# EAGLE design PCBLAGO (EAGLE 9.5.1)
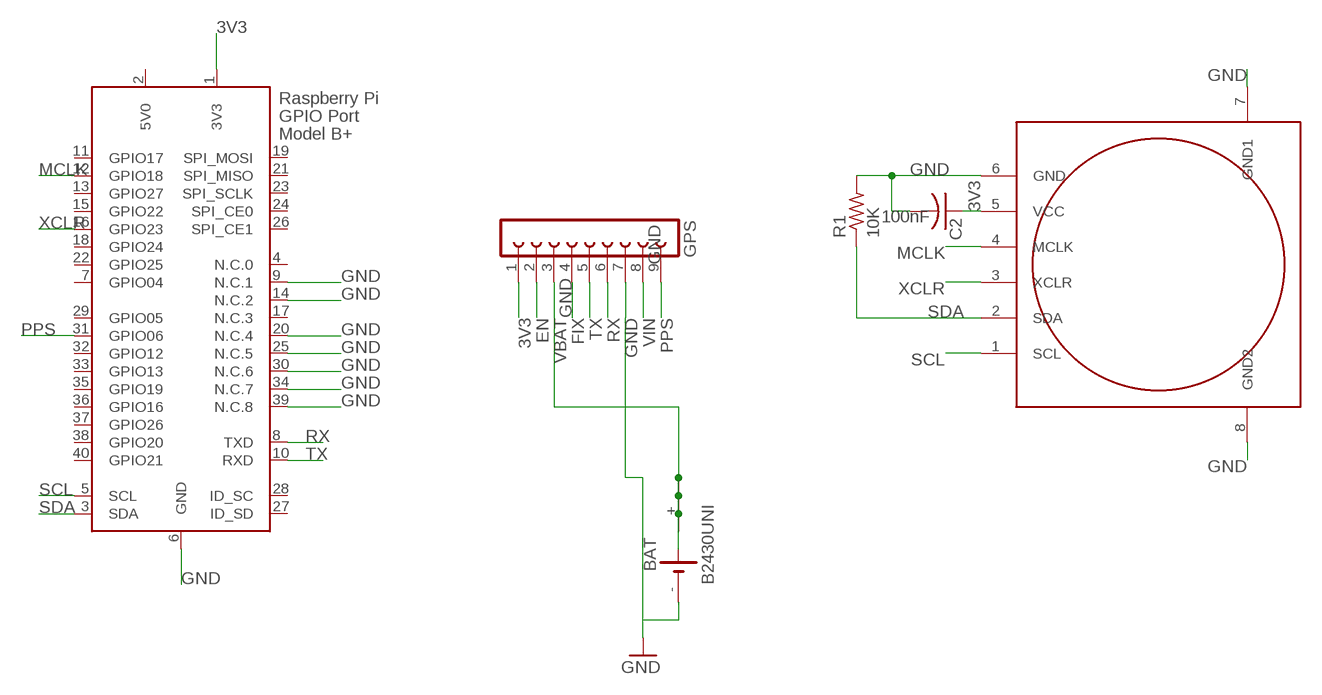
[diagram p0: schematic, sheet 1]

## Parts
BAT  B2430UNI  [B2430UNI]
C2  100nF  C-USC0805K  [C0805K]
GPS  FE09-1  [FE09]
R1  10K  R-US_M0805  [M0805]
U$1  HP03S  [HP03S]
X1  RASPI_BOARD_B+_F  [RASPI_BOARD_B+_FULL]

## Nets
3V3 [New Class]: C2.1 GPS.1 U$1.5(VCC) X1.1(3V3)
EN: GPS.2
FIX: GPS.4
GND: BAT.- C2.2 GPS.7 R1.2 U$1.6(GND) U$1.7(GND1) U$1.8(GND2) X1.6(GND) X1.9(N.C.1) X1.14(N.C.2) X1.20(N.C.4) X1.25(N.C.5) X1.30(N.C.6) X1.34(N.C.7) X1.39(N.C.8)
MCLK: U$1.4(MCLK) X1.12(GPIO18)
PPS: GPS.9 X1.31(GPIO06)
RX: GPS.6 X1.8(TXD)
SCL: U$1.1(SCL) X1.5(SCL)
SDA: R1.1 U$1.2(SDA) X1.3(SDA)
TX: GPS.5 X1.10(RXD)
VBAT: BAT.+ BAT.+@1(+) BAT.+@2(+) BAT.+@3(+) BAT.+@4(+) GPS.3
VIN: GPS.8
XCLR: U$1.3(XCLR) X1.16(GPIO23)
Unconnected: BAT.-@1(-) X1.4(N.C.0) X1.7(GPIO04) X1.11(GPIO17) X1.13(GPIO27) X1.15(GPIO22) X1.17(N.C.3) X1.18(GPIO24) X1.19(SPI_MOSI) X1.21(SPI_MISO) X1.22(GPIO25) X1.23(SPI_SCLK) X1.24(SPI_CE0) X1.26(SPI_CE1) X1.27(ID_SD) X1.28(ID_SC) X1.29(GPIO05) X1.32(GPIO12) X1.33(GPIO13) X1.35(GPIO19) X1.36(GPIO16) X1.37(GPIO26) X1.38(GPIO20) X1.40(GPIO21)

## Power pins joined to a net without a drawn wire
5V0: X1.2(5V0)

## Library data of the parts
BAT = battery:B2430UNI: LI BATTERY
C2 = rcl:C-US: CAPACITOR, American symbol
GPS = con-lsta:FE09-1: FEMALE HEADER; OC_FARNELL: unknown; OC_NEWARK: unknown
R1 = rcl:R-US_: RESISTOR, American symbol
U$1 = LAGO:HP03S
X1 = raspberrypi_bastelstube_v13:RASPI_BOARD_B+: Raspberry Pi GPIO connector with markings for the outer dimensions of the Raspberry Pi board model B+ with different sets of drill holes or mounting pads

## Board
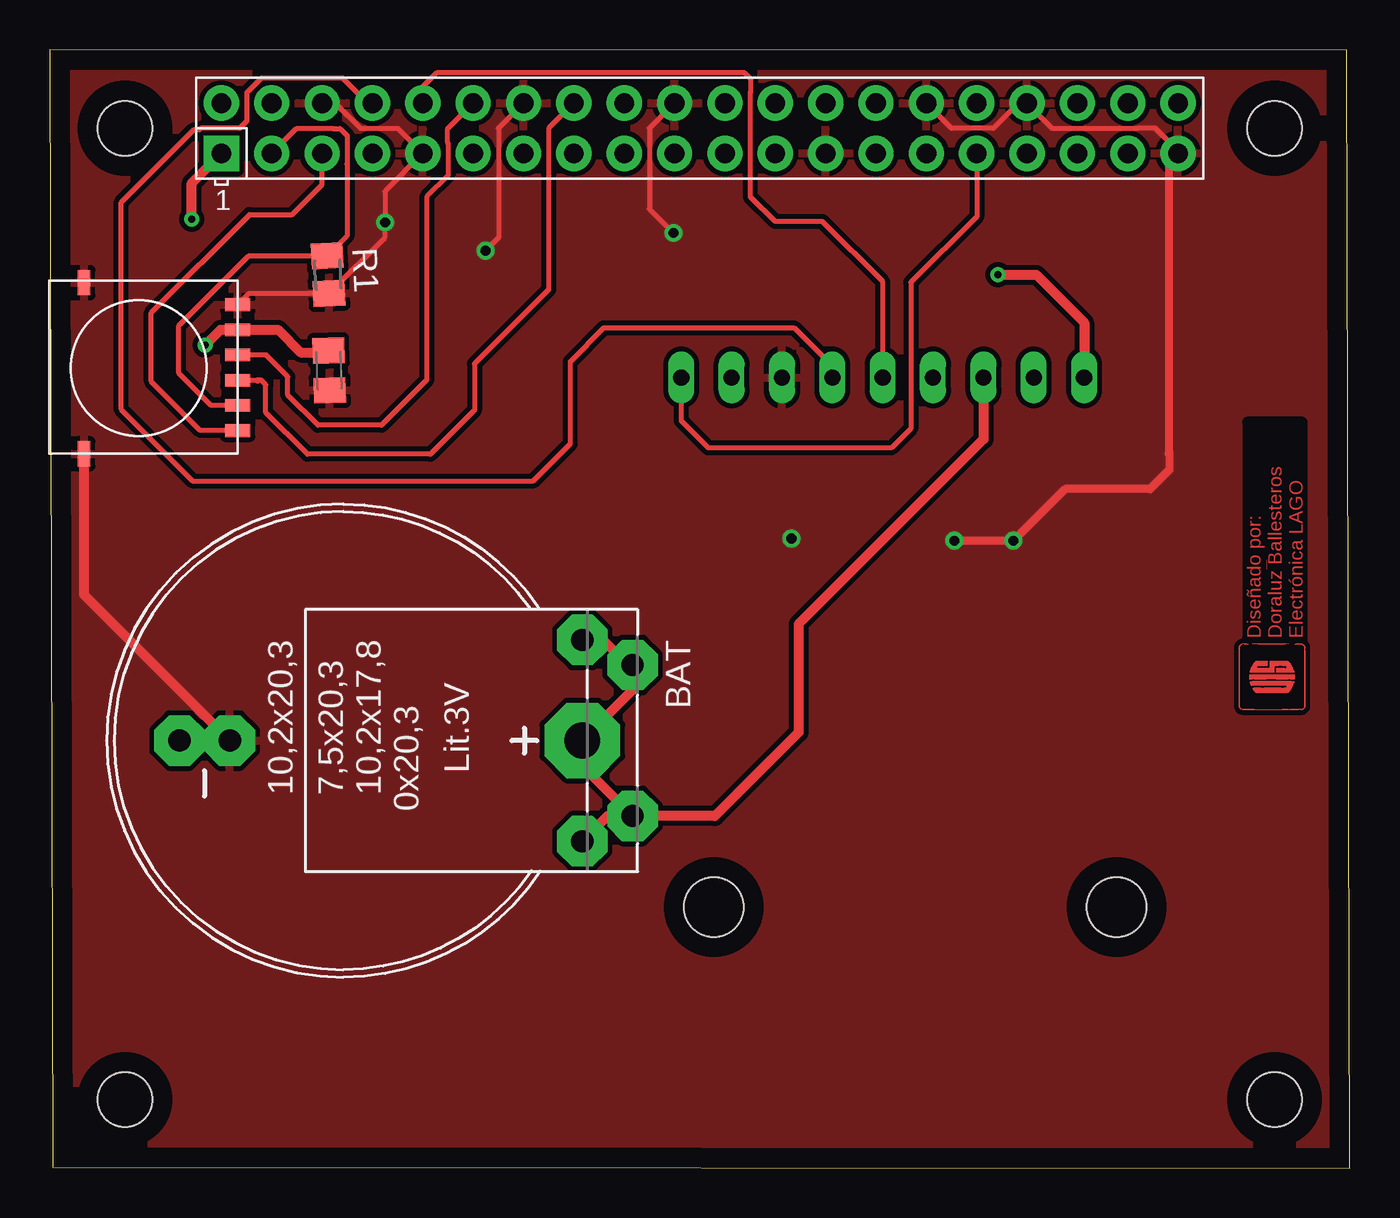
[diagram p1: board, top side]
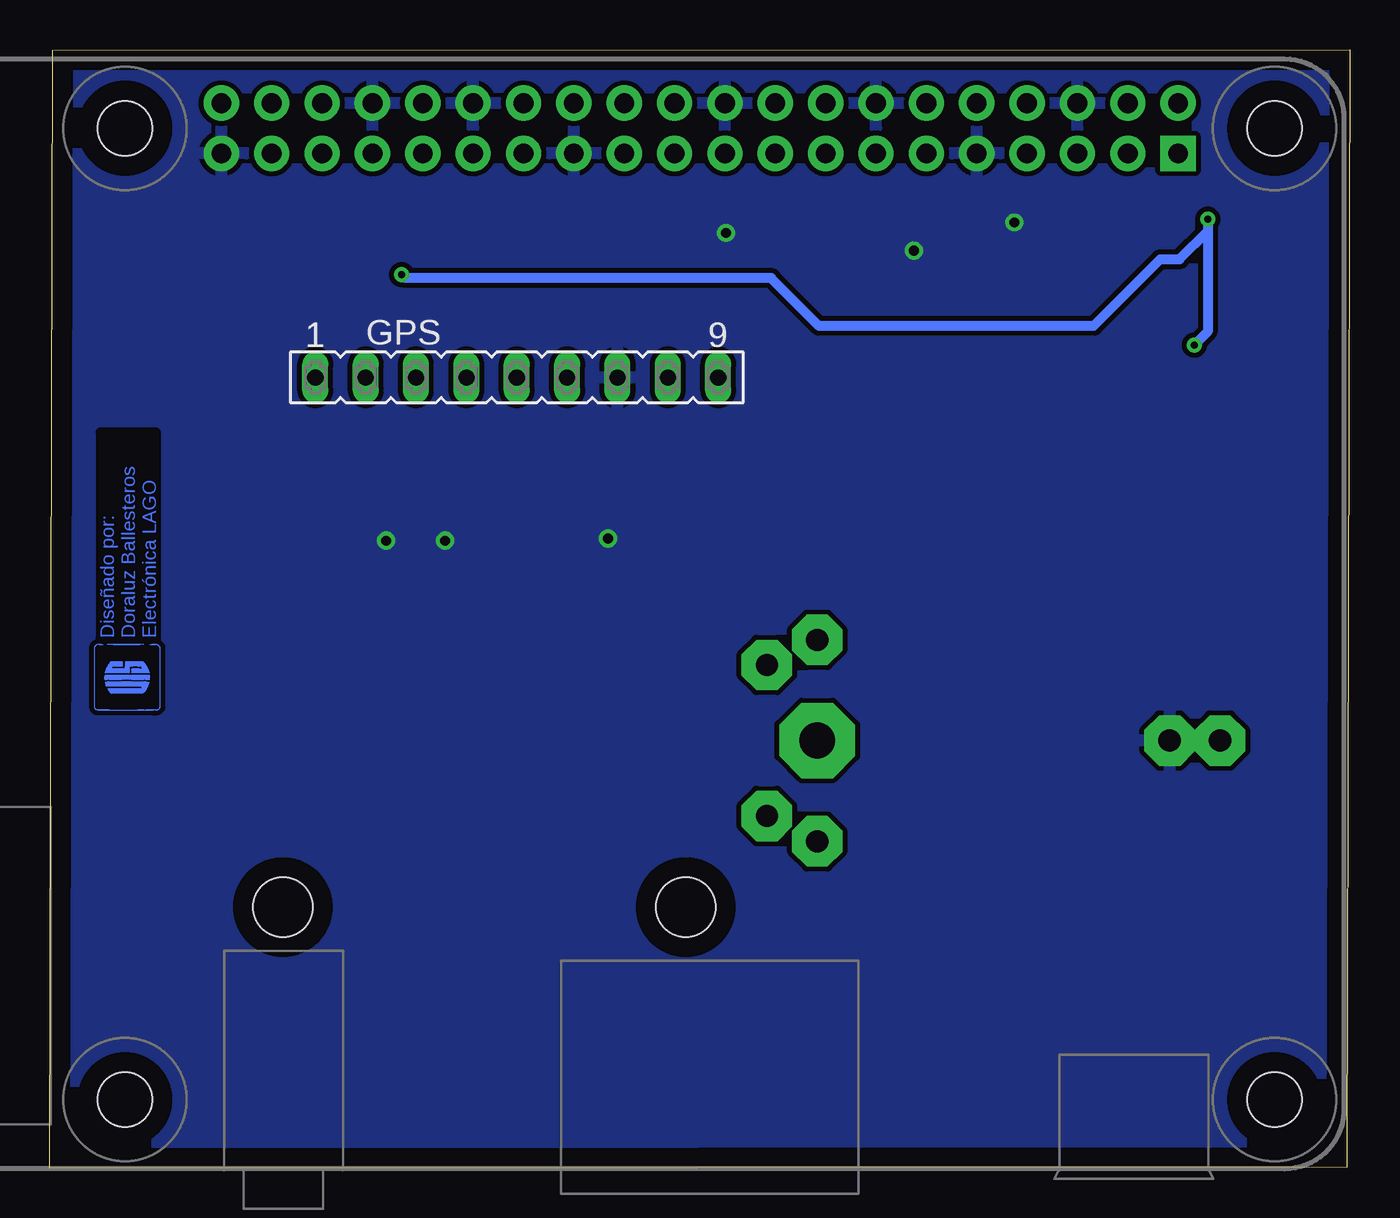
[diagram p2: board, bottom side, seen from below]

Size 65.6 x 56.43 mm. Coordinates in mm from the lower left corner, seen from the top.
Outline: 0.17,0.03 65.6,0 65.43,56.4 0,56.43 0.17,0.03
Copper layers (1*16): Top 0.035mm / dielectric 1.5mm / Bottom 0.035mm
Design rules "default *": minimum track width 6mil, minimum drill 0.35mm, track to track 0.25mm, track to pad 0.25mm, pad to pad 0.25mm, via to via 0.25mm, smd to smd 6mil, copper to edge 40mil, drill to drill 6mil, minimum pad ring 10mil, minimum via ring 8mil, stop-mask expansion 4mil, vias tented up to drill 0mil, thermal gap 10mil
Holes 3 mm at 33.51,13.17 53.83,13.17

### Footprints (pad centres in the part's own frame; a part is rotated, then mirrored left to right if it is on the bottom)
B2430UNI = drill 1.118 pad 2.54 octagon: + 3.81,14.605; +@1 -3.81,14.605; +@2 -5.08,12.065; +@3 5.08,12.065; - 0,-5.715; -@1 0,-8.255 | drill 1.803 pad 3.81 octagon: +@4 0,12.065
C0805K = smd 1.3 x 1.6: 1 -1,0; 2 1,0
FE09 = drill 0.813 long: 1 -10.16,0; 2 -7.62,0; 3 -5.08,0; 4 -2.54,0; 5 0,0; 6 2.54,0; 7 5.08,0; 8 7.62,0; 9 10.16,0
M0805 = smd 1.3 x 1.6: 1 -0.95,0; 2 0.95,0
HP03S = smd 1.27 x 0.635: 1 0,-3.14; 2 0,-1.87; 3 0,-0.6; 4 0,0.67; 5 0,1.94; 6 0,3.21 | smd 0.635 x 1.27: 7 -7.747,4.318; 8 -7.747,-4.318
RASPI_BOARD_B+_FULL = drill 1 pad 1.778 square: 1 8.37,51.23 | drill 1 pad 1.778: 2 8.37,53.77; 3 10.91,51.23; 4 10.91,53.77; 5 13.45,51.23; 6 13.45,53.77; 7 15.99,51.23; 8 15.99,53.77; 9 18.53,51.23; 10 18.53,53.77; 11 21.07,51.23; 12 21.07,53.77; 13 23.61,51.23; 14 23.61,53.77; 15 26.15,51.23; 16 26.15,53.77; 17 28.69,51.23; 18 28.69,53.77; 19 31.23,51.23; 20 31.23,53.77; 21 33.77,51.23; 22 33.77,53.77; 23 36.31,51.23; 24 36.31,53.77; 25 38.85,51.23; 26 38.85,53.77; 27 41.39,51.23; 28 41.39,53.77; 29 43.93,51.23; 30 43.93,53.77; 31 46.47,51.23; 32 46.47,53.77; 33 49.01,51.23; 34 49.01,53.77; 35 51.55,51.23; 36 51.55,53.77; 37 54.09,51.23; 38 54.09,53.77; 39 56.63,51.23; 40 56.63,53.77 | hole 2.75: 3.5,3.5; 3.5,52.5; 61.5,3.5; 61.5,52.5

### Placement (x,y rotation side)
BAT  14.81,21.57 270 top
C2  14.1,40.24 271.8 top
GPS  42.03,39.89 0 bottom
R1  14.05,45.08 272.9 top
U$1  9.49,40.35 0 top
X1  0.3,-0.04 0 top

### Tracks (layer width: path | path; a pad name or v marks a point on that pad's centre or on a via)
3V3  (via drill 0.35)
  Top 0.25: 13.99,41.16 C2.1
  Top 0.508: C2.1 14.14,41.15 | 14.14,41.15 14.17,41.1 | v47.83,45.07 49.77,45.07 52.19,42.65 GPS.1 | v7.17,47.88 7.17,49.69 X1.1 | v7.86,41.52 8.63,42.29 U$1.5 11.53,42.29 12.67,41.15 14.14,41.15
  Bottom 0.508: 47.83,44.95 v47.83,45.07 47.66,44.9 29.2,44.9 26.78,42.48 12.94,42.48 9.57,45.85 8.6,45.85 7.17,47.28 v7.17,47.88 7.17,42.21 v7.86,41.52
GND  (via drill 0.5)
  Top 0.25: X1.39 56.93,51.32 55.77,52.48 54.93,52.48 54.91,52.47 50.57,52.47 X1.34 48.88,53.73 47.61,52.46 45.5,52.46 X1.30 | 48.57,31.71 v48.63,31.65 | U$1.6 10.06,44.13 R1.2 16.92,46.95 v16.92,47.71 16.92,49.28 X1.9 17.56,52.46 15.68,52.46 14.41,53.73 X1.6 | X1.14 22.64,52.46 22.64,46.94 v21.99,46.29
  Top 0.254: X1.20 30.26,52.46 30.26,48.39 v31.47,47.18
  Top 0.406: X1.39 56.46,50.72 56.46,36.03 | v45.64,31.65 48.56,31.65 48.59,31.61 v48.63,31.65 51.23,34.25 55.51,34.25 56.5,35.24 56.5,36.05
  Top 0.508: BAT.- 1.74,28.92 U$1.8
  other vias: 37.43,31.76
  pour Top: 0.53,56.14 65.55,56.14 65.55,0.1 0.53,0.1
  pour Bottom: 0.32,56.28 0.32,0.45 65.88,0.45 65.88,56.28
MCLK
  Top 0.25: X1.12 20.08,52.44 20.08,51.73 20.09,51.71 20.09,50.06 19.03,49 19.03,39.76 16.75,37.48 13.54,37.48 12.02,39 12.02,39.93 10.93,41.02 U$1.4
PPS
  Top 0.25: X1.31 46.77,48.01 43.45,44.69 43.45,37.32 42.46,36.33 33.23,36.33 31.87,37.69 GPS.9
RX
  Top 0.25: X1.8 16.04,53.73 14.78,54.99 10.69,54.99 9.95,54.25 9.95,52.82 9.58,52.45 7.63,52.45 7.55,52.38 7.28,52.38 3.6,48.7 3.6,38.3 7.23,34.67 24.4,34.67 26.27,36.54 26.27,40.69 27.97,42.39 37.55,42.39 39.49,40.45 GPS.6
SCL
  Top 0.25: U$1.1 7.61,37.21 5.13,39.69 5.13,43.15 10.09,48.11 12.25,48.11 13.75,49.61 X1.5
SDA
  Top 0.25: U$1.2 8.16,38.48 6.52,40.12 6.52,42.5 10.05,46.03 R1.1 15,47.03 15,50.65 15.01,50.67 15.01,52.08 14.65,52.44 14.29,52.44 14.27,52.45 12.47,52.45 X1.3
TX
  Top 0.25: X1.10 18.83,54.56 19.55,55.28 19.56,55.27 35.05,55.26 35.35,54.96 35.35,54.26 35.35,54.25 35.35,49.01 36.61,47.75 38.99,47.75 42.03,44.71 GPS.5
VBAT
  Top 0.508: GPS.3 47.11,36.77 37.78,27.44 37.78,21.98 33.56,17.76 BAT.+ | BAT.+ 26.88,20.3 BAT.+@4 29.42,24.11 29.42,25.15 | BAT.+@3 28.14,17.76 BAT.+ | 29.42,25.15 BAT.+@1 | BAT.+@2 27.92,26.65 29.42,25.15
XCLR
  Top 0.25: X1.16 25.17,52.45 25.17,44.32 21.43,40.58 21.43,38.24 19.21,36.02 13.01,36.02 10.91,38.12 10.91,39.52 10.68,39.75 10.45,39.75 | U$1.3 10.45,39.75 | 10.45,39.75 10.5,39.7
(copper drawn outside any net)
  shapes: Bottom area x1745, Top area x1744

### Text on the board
Top: Diseñado por: / Doraluz Ballesteros / Electrónica LAGO
Bottom: Diseñado por: / Doraluz Ballesteros / Electrónica LAGO